# Altium project STATION.PRJPCB
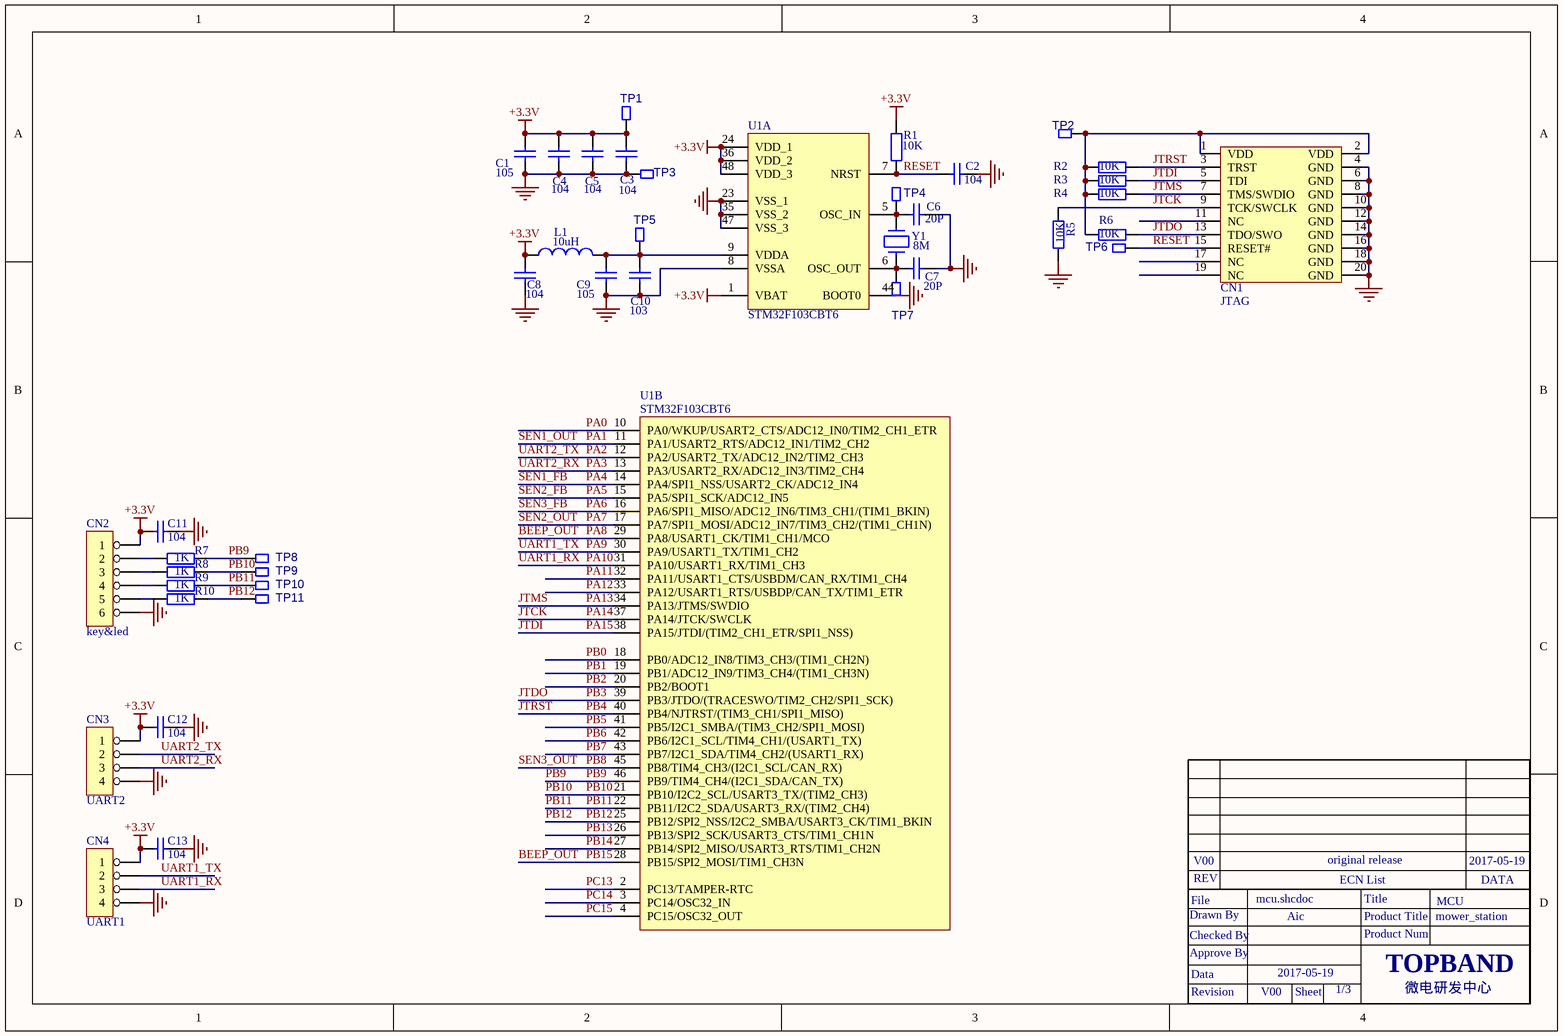
[diagram p0: mcu.SchDoc]
3 sheets, 192 parts. Net scope: flat (ports and power ports of the same name join across sheets).
Sheets:
  mcu.SchDoc
  power.SchDoc
  sensor.SchDoc

## Sheet mcu.SchDoc
size A4

### Parts
C1  105  [0603C]
C2  104  [0603C]
C3  104  [0603C]
C4  104  [0603C]
C5  104  [0603C]
C6  20P  [0603C]
C7  20P  [0603C]
C8  104  [0603C]
C9  105  [0603C]
C10  103  [0603C]
C11  104  [0603C]
C12  104  [0603C]
C13  104  [0603C]
CN1  JTAG  [JTAG_20]
CN2  key&led  [CON6-2.54]
CN3  UART2  [CON4-2.54]
CN4  UART1  [CON4-2.54]
L1  10uH  [0805L-BOT]
R1  10K  [0603R]
R2  10K  [0603R]
R3  10K  [0603R]
R4  10K  [0603R]
R5  10K  [0603R]
R6  10K  [0603R]
R7  1K  [0603R]
R8  1K  [0603R]
R9  1K  [0603R]
R10  1K  [0603R]
TP1  TP  [TEST-0.8MM]  (value not drawn)
TP2  TP  [TEST-0.8MM]  (value not drawn)
TP3  TP  [TEST-0.8MM]  (value not drawn)
TP4  TP  [TEST-0.8MM]  (value not drawn)
TP5  TP  [TEST-0.8MM]  (value not drawn)
TP6  TP  [TEST-0.8MM]  (value not drawn)
TP7  TP  [TEST-0.8MM]  (value not drawn)
TP8  TP  [TEST-0.8MM]  (value not drawn)
TP9  TP  [TEST-0.8MM]  (value not drawn)
TP10  TP  [TEST-0.8MM]  (value not drawn)
TP11  TP  [TEST-0.8MM]  (value not drawn)
U1  STM32F103CBT6  [LQFP48]  (parts A,B of 2)
Y1  8M  [XTAL-J]

### Nets
+3.3V: C1.1 C3.1 C4.1 C5.1 C8.1 C11.1 C12.1 C13.1 CN2.1 CN3.1 CN4.1 L1.1 R1.1 TP1.1 U1.1(VBAT) U1.24(VDD_1) U1.36(VDD_2) U1.48(VDD_3)
GND: C1.2 C2.1 C3.2 C4.2 C5.2 C6.1 C7.1 C8.2 C9.2 C10.2 C11.2 C12.2 C13.2 CN1.4(GND) CN1.6(GND) CN1.8(GND) CN1.10(GND) CN1.12(GND) CN1.14(GND) CN1.16(GND) CN1.18(GND) CN1.20(GND) CN2.6 CN3.4 CN4.4 R5.2 TP3.1 U1.8(VSSA) U1.23(VSS_1) U1.35(VSS_2) U1.44(BOOT0) U1.47(VSS_3)  [project net +5V]
BEEP_OUT: U1.28(PB15/SPI2_MOSI/TIM1_CH3N) U1.29(PA8/USART1_CK/TIM1_CH1/MCO)  [also labelled PA8, PB15]
JTCK: CN1.9(TCK/SWCLK) R5.1 U1.37(PA14/JTCK/SWCLK)  [also labelled PA14]
JTDI: CN1.5(TDI) R3.1 U1.38(PA15/JTDI/(TIM2_CH1_ETR/SPI1_NSS))  [also labelled PA15]
JTDO: CN1.13(TDO/SWO) R6.1 U1.39(PB3/JTDO/(TRACESWO/TIM2_CH2/SPI1_SCK))  [also labelled PB3]
JTMS: CN1.7(TMS/SWDIO) R4.1 U1.34(PA13/JTMS/SWDIO)  [also labelled PA13]
JTRST: CN1.3(TRST) R2.1 U1.40(PB4/NJTRST/(TIM3_CH1/SPI1_MISO))  [also labelled PB4]
PA0: U1.10(PA0/WKUP/USART2_CTS/ADC12_IN0/TIM2_CH1_ETR)
PA1: U1.11(PA1/USART2_RTS/ADC12_IN1/TIM2_CH2)  [also labelled SEN1_OUT]
PA2: CN3.2 U1.12(PA2/USART2_TX/ADC12_IN2/TIM2_CH3)  [also labelled UART2_TX]
PA3: CN3.3 U1.13(PA3/USART2_RX/ADC12_IN3/TIM2_CH4)  [also labelled UART2_RX]
PA4: U1.14(PA4/SPI1_NSS/USART2_CK/ADC12_IN4)  [also labelled SEN1_FB]
PA5: U1.15(PA5/SPI1_SCK/ADC12_IN5)  [also labelled SEN2_FB]
PA6: U1.16(PA6/SPI1_MISO/ADC12_IN6/TIM3_CH1/(TIM1_BKIN))  [also labelled SEN3_FB]
PA7: U1.17(PA7/SPI1_MOSI/ADC12_IN7/TIM3_CH2/(TIM1_CH1N))  [also labelled SEN2_OUT]
PA9: CN4.2 U1.30(PA9/USART1_TX/TIM1_CH2)  [also labelled UART1_TX]
PA10: CN4.3 U1.31(PA10/USART1_RX/TIM1_CH3)  [also labelled UART1_RX]
PA11: U1.32(PA11/USART1_CTS/USBDM/CAN_RX/TIM1_CH4)
PA12: U1.33(PA12/USART1_RTS/USBDP/CAN_TX/TIM1_ETR)
PB0: U1.18(PB0/ADC12_IN8/TIM3_CH3/(TIM1_CH2N))
PB1: U1.19(PB1/ADC12_IN9/TIM3_CH4/(TIM1_CH3N))
PB2: U1.20(PB2/BOOT1)
PB5: U1.41(PB5/I2C1_SMBA/(TIM3_CH2/SPI1_MOSI))
PB6: U1.42(PB6/I2C1_SCL/TIM4_CH1/(USART1_TX))
PB7: U1.43(PB7/I2C1_SDA/TIM4_CH2/(USART1_RX))
PB8: U1.45(PB8/TIM4_CH3/(I2C1_SCL/CAN_RX))  [also labelled SEN3_OUT]
PB9: R7.2 TP8.1 U1.46(PB9/TIM4_CH4/(I2C1_SDA/CAN_TX))
PB10: R8.2 TP9.1 U1.21(PB10/I2C2_SCL/USART3_TX/(TIM2_CH3))
PB11: R9.2 TP10.1 U1.22(PB11/I2C2_SDA/USART3_RX/(TIM2_CH4))
PB12: R10.2 TP11.1 U1.25(PB12/SPI2_NSS/I2C2_SMBA/USART3_CK/TIM1_BKIN)
PB13: U1.26(PB13/SPI2_SCK/USART3_CTS/TIM1_CH1N)
PB14: U1.27(PB14/SPI2_MISO/USART3_RTS/TIM1_CH2N)
PC13: U1.2(PC13/TAMPER-RTC)
PC14: U1.3(PC14/OSC32_IN)
PC15: U1.4(PC15/OSC32_OUT)
RESET: C2.2 CN1.15(RESET#) R1.2 TP6.1 U1.7(NRST)
NetC6_2: C6.2 TP4.1 U1.5(OSC_IN) Y1.2
NetC7_2: C7.2 TP7.1 U1.6(OSC_OUT) Y1.1
NetC9_1: C9.1 C10.1 L1.2 TP5.1 U1.9(VDDA)
NetCN1_1: CN1.1(VDD) CN1.2(VDD) R2.2 R3.2 R4.2 R6.2 TP2.1
NetCN2_2: CN2.2 R7.1
NetCN2_3: CN2.3 R8.1
NetCN2_4: CN2.4 R9.1
NetCN2_5: CN2.5 R10.1

Not connected (* = marked no-connect by the designer): CN1 11(NC) 17(NC) 19(NC)

### Notes on the sheet
- Drawn By
- File
- REV
- V00
- mcu.shcdoc
- Aic
- original release
- ECN List
- Product Title
- Title
- mower_station
- MCU
- 2017-05-19
- DATA
- Approve By
- Checked By
- Data
- Product Num
- TOPBAND
- Revision
- Sheet
- 1/3
- 微电研发中心

### Library data of the parts
C1-C13 = Cap(0603): Component Kind: standard; Component Type: standard
CN2 = 6Pin: 插座; U_TABLE: U_SAM01021601; id: 34; Part Number: 6Pin; Component Kind: Standard; Component Type: Standard; Designator: 6Pin; Pin Count: 6
CN3 CN4 = 4Pin(2~3.96mm): 插座; U_TABLE: U_SAM01021601; id: 28; Part Number: 4Pin(2~3.96mm); Component Kind: Standard; Component Type: Standard; Designator: 4Pin(2~3.96mm); Footprint: CON4-2.0; Pin Count: 4
L1 = Inductor(0805): 电感; U_TABLE: U_SAM010207; id: 140; Part Number: Inductor(0805); Component Kind: standard; Component Type: standard
R1-R6 = Res2: Resistor; Value: 1K; 物料编码: 150103083; Published: 8-Jun-2000; LatestRevisionDate: 17-Jul-2002; LatestRevisionNote: Re-released for DXP Platform.; PackageReference: AXIAL-0.4; Publisher: Altium Limited
R7-R10 = Res(0603): 120100221; U_TABLE: U_SAM010201; id: 106; Description: 电阻器; U_ITEM_ID（物料编码）: 120101813; U_100114（SAP物料描述）: SMT电阻RR0603_1502_F_1/16W_50V_国巨_; U_100012（标称值-文本）: 1502; U_100116（标称值-浮点）: 15; U_100013（单位）: KΩ; U_100083（允许偏差）: F; U_100029（额定功率）: 1/16W; U_100040（封装方式）: RR0603; U_100049（极限电压）: 50V; U_100047（环保属性）: 环保; U_100107（工厂BOM使用频率）: 2000:8;; U_100105（工厂库存）: 1200:0.000;2000:3965.000;3000:0.000;; U_100117（工厂采购量）: 2000:5000.000;; Part Number: Res(0603); Component Kind: standard; Component Type: standard; U_100086（指定供应商）: 国巨
U1 = STM32F103x8
Y1 = XTAL-J: 晶振; U_TABLE: U_SAM010212; id: 101; Part Number: XTAL-J; Component Kind: standard; Component Type: standard; Pin Count: 2

## Sheet power.SchDoc
size A4
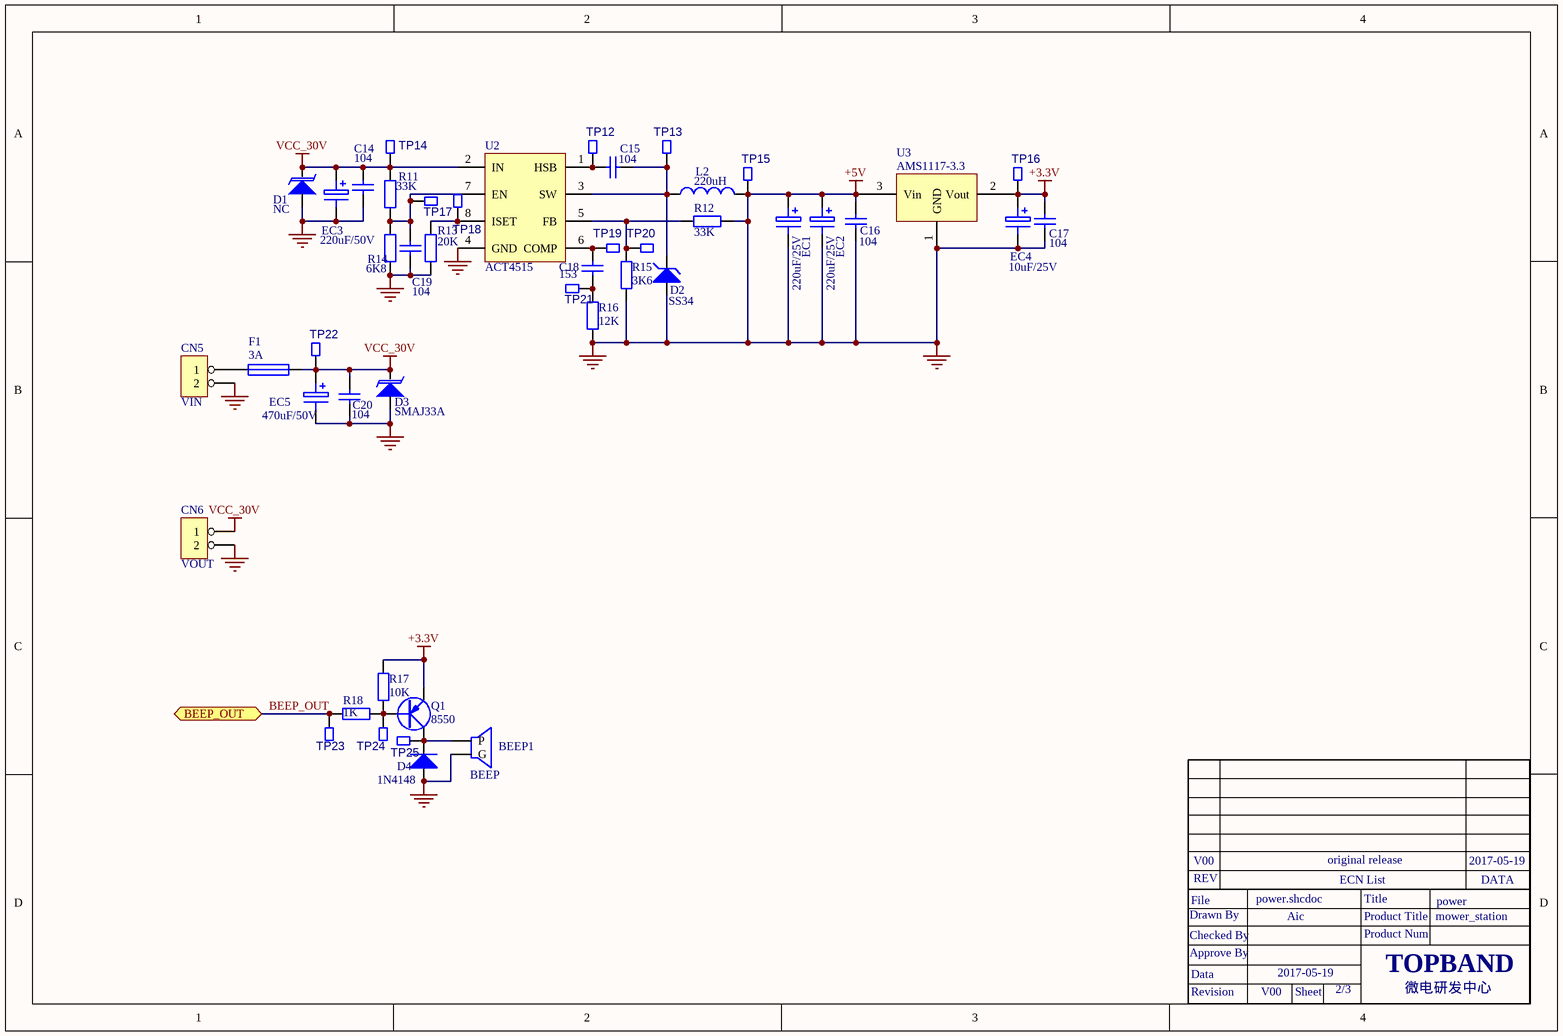
[diagram p1: power.SchDoc]

### Parts
BEEP1  BEEP  [BELL-5]
C14  104  [0603C]
C15  104  [0603C]
C16  104  [0603C]
C17  104  [0603C]
C18  153  [0603C]
C19  104  [0603C]
C20  104  [0805C]
CN5  VIN  [CON2-2.54]
CN6  VOUT  [CON2-2.54]
D1  NC  [SOD-123]
D2  SS34  [SMA]
D3  SMAJ33A  [DO-214AC]
D4  1N4148  [SOD-123]
EC1  220uF/25V  [EC10]
EC2  220uF/25V  [EC10]
EC3  220uF/50V  [EC10]
EC4  10uF/25V  [EC4]
EC5  470uF/50V  [EC12.5]
F1  3A  [0603]
L2  220uH  [150700618]
Q1  8550  [SOT-23-BCE]
R11  33K  [0603R]
R12  33K  [0603R]
R13  20K  [0603R]
R14  6K8  [0603R]
R15  3K6  [0603R]
R16  12K  [0603R]
R17  10K  [0603R]
R18  1K  [0603R]
TP12  TP  [TEST-0.8MM]  (value not drawn)
TP13  TP  [TEST-0.8MM]  (value not drawn)
TP14  TP  [TEST-0.8MM]  (value not drawn)
TP15  TP  [TEST-0.8MM]  (value not drawn)
TP16  TP  [TEST-0.8MM]  (value not drawn)
TP17  TP  [TEST-0.8MM]  (value not drawn)
TP18  TP  [TEST-0.8MM]  (value not drawn)
TP19  TP  [TEST-0.8MM]  (value not drawn)
TP20  TP  [TEST-0.8MM]  (value not drawn)
TP21  TP  [TEST-0.8MM]  (value not drawn)
TP22  TP  [TEST-0.8MM]  (value not drawn)
TP23  TP  [TEST-0.8MM]  (value not drawn)
TP24  TP  [TEST-0.8MM]  (value not drawn)
TP25  TP  [TEST-0.8MM]  (value not drawn)
U2  ACT4515  [SOP-8]
U3  AMS1117-3.3  [SOT-223]

### Ports
BEEP_OUT

### Nets
+3.3V: C17.1 EC4.1 Q1.E R17.2 TP16.1 U3.2(Vout)
+5V: BEEP1.2(G) C14.2 C16.1 C16.2 C17.2 C19.2 C20.1 CN5.2 CN6.2 D1.A D2.A D3.A D4.A EC1.1 EC1.2 EC2.1 EC2.2 EC3.2 EC4.2 EC5.2 L2.2 R12.1 R13.2 R14.2 R15.1 R16.1 TP15.1 U2.4(GND) U3.1(GND) U3.3(Vin)  [also labelled GND]
VCC_30V: C14.1 C20.2 CN6.1 D1.K D3.K EC3.1 EC5.1 F1.2 R11.1 TP14.1 TP22.1 U2.2(IN)
BEEP_OUT: R18.1 TP23.1 ; port BEEP_OUT
NetBEEP1_1: BEEP1.1(P) D4.K Q1.C TP25.1
NetC15_1: C15.1 TP12.1 U2.1(HSB)
NetC15_2: C15.2 D2.K L2.1 TP13.1 U2.3(SW)
NetC18_1: C18.1 TP19.1 U2.6(COMP)
NetC18_2: C18.2 R16.2 TP21.1
NetC19_1: C19.1 R11.2 R14.1 TP17.1 U2.7(EN)
NetCN5_1: CN5.1 F1.1
NetQ1_B: Q1.B R17.1 R18.2 TP24.1
NetR12_2: R12.2 R15.2 TP20.1 U2.5(FB)
NetR13_1: R13.1 TP18.1 U2.8(ISET)

### Notes on the sheet
- Drawn By
- File
- REV
- V00
- power.shcdoc
- Aic
- original release
- ECN List
- Product Title
- Title
- mower_station
- power
- 2017-05-19
- DATA
- Approve By
- Checked By
- Data
- Product Num
- TOPBAND
- Revision
- Sheet
- 2/3
- 微电研发中心

### Library data of the parts
C14-C20 = Cap(0603): Component Kind: standard; Component Type: standard
CN5 CN6 = 2Pin(卧式): 插座; U_TABLE: U_SAM01021601; id: 20; Part Number: 2Pin(卧式); Component Kind: Standard; Component Type: Standard; Designator: 2Pin(卧式); Footprint: CON2-2.54卧式; Pin Count: 2
D1 = Diode(TVS_贴片)_1: TVS管; U_TABLE: U_SAM010203; id: 28; Part Number: Diode(TVS_贴片)_1; Component Kind: standard; Component Type: standard; Pin Count: 2
D2 = D Zener(贴片): 120301465; U_TABLE: U_SAM010203; id: 25; Description: 稳压二极管; Part Number: D Zener(贴片); Component Kind: standard; Component Type: standard; Pin Count: 2
D3 = Diode(TVS_贴片)_1: 120301346; U_TABLE: U_SAM010203; id: 28; Description: TVS管; Part Number: Diode(TVS_贴片)_1; Component Kind: standard; Component Type: standard; Pin Count: 2
D4 = Diode(DO-35)-D: 二极管; U_TABLE: U_SAM010203; id: 32; Part Number: Diode(DO-35)-D; Component Kind: standard; Component Type: standard; Pin Count: 2
EC1-EC4 = Electro(2.5mm): 电解电容; U_TABLE: U_SAM010202; id: 42; Part Number: Electro(2.5mm); Component Kind: standard; Component Type: standard; Pin Count: 2
EC5 = Electro(2.5mm): 150200079; U_TABLE: U_SAM010202; id: 42; Description: 电解电容; Part Number: Electro(2.5mm); Component Kind: standard; Component Type: standard; Pin Count: 2
F1 = Fuse(1206): 121100112; U_TABLE: U_SAM010211; id: 119; Description: 保险管; Part Number: Fuse(1206); Component Kind: standard; Component Type: standard
L2 = Inductor(0805): 150700618; U_TABLE: U_SAM010207; id: 140; Description: 电感; Part Number: Inductor(0805); Component Kind: standard; Component Type: standard
Q1 = PNP(贴片): 三极管; U_TABLE: U_SAM010204; id: 20; Part Number: PNP(贴片); Component Kind: standard; Component Type: standard; Pin Count: 3
R11-R16 = Res2: Resistor; Value: 1K; 物料编码: 150103083; Published: 8-Jun-2000; LatestRevisionDate: 17-Jul-2002; LatestRevisionNote: Re-released for DXP Platform.; PackageReference: AXIAL-0.4; Publisher: Altium Limited
R17 R18 = Res(0603): as R7 on sheet mcu; Part Number: Res(0603); Component Kind: standard; Component Type: standard; U_100086（指定供应商）: 国巨

## Sheet sensor.SchDoc
size A4
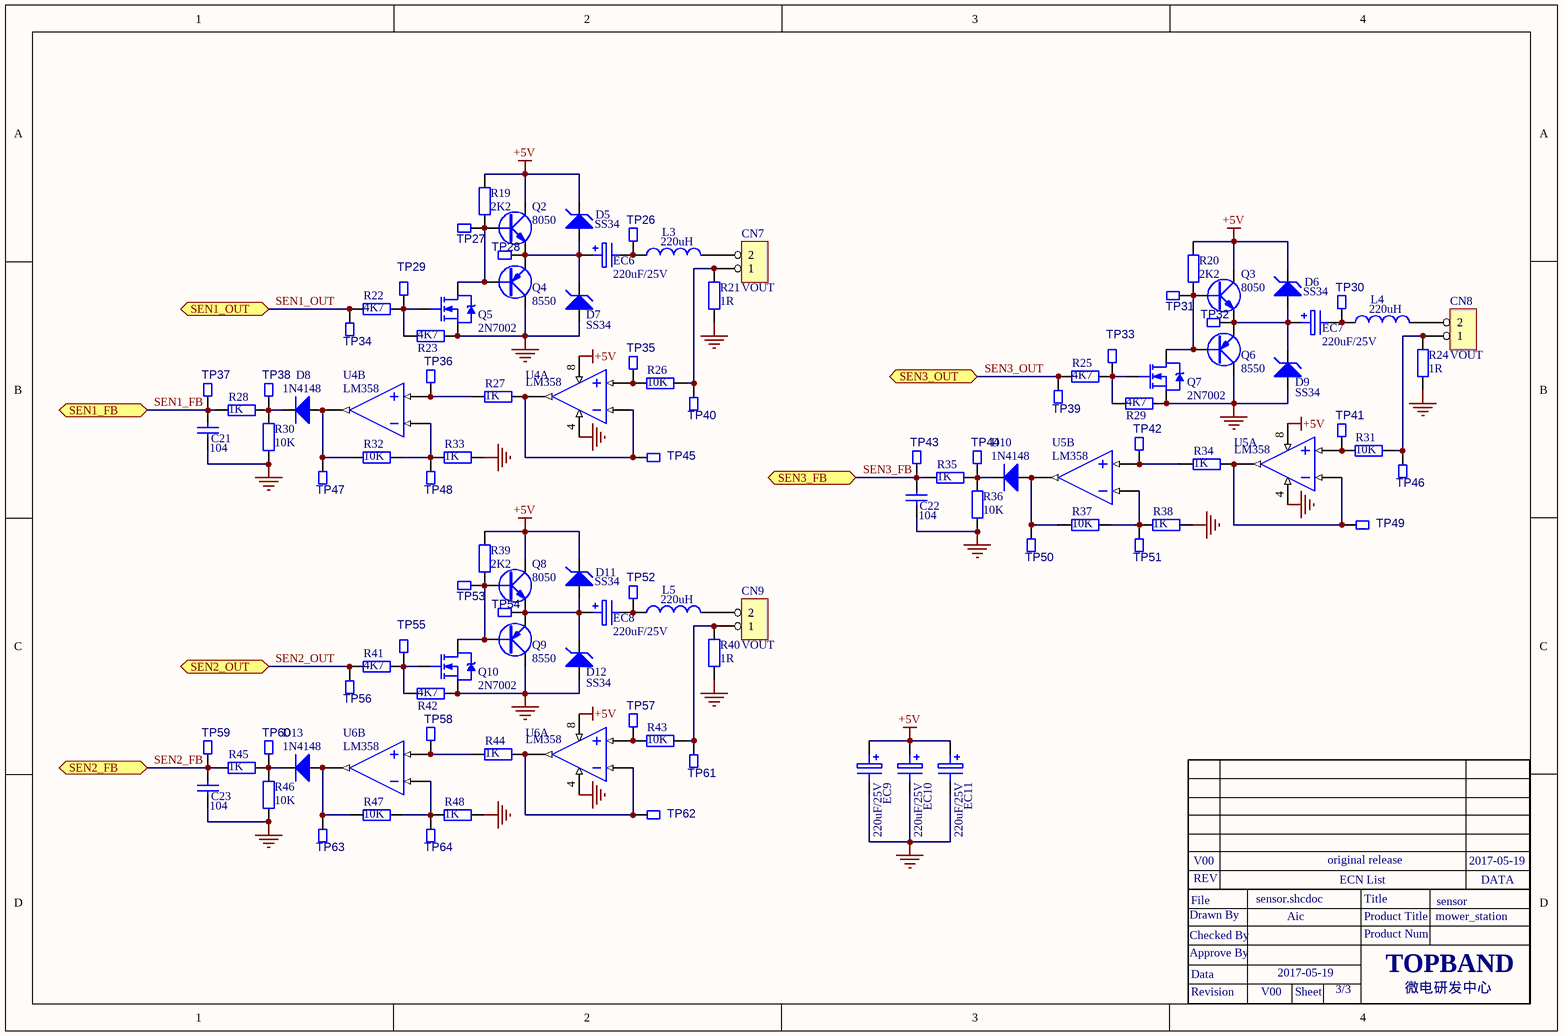
[diagram p2: sensor.SchDoc]

### Parts
C21  104  [0805C]
C22  104  [0805C]
C23  104  [0805C]
CN7  VOUT  [CON2-2.54]
CN8  VOUT  [CON2-2.54]
CN9  VOUT  [CON2-2.54]
D5  SS34  [SMA]
D6  SS34  [SMA]
D7  SS34  [SMA]
D8  1N4148  [SOD-123]
D9  SS34  [SMA]
D10  1N4148  [SOD-123]
D11  SS34  [SMA]
D12  SS34  [SMA]
D13  1N4148  [SOD-123]
EC6  220uF/25V  [EC10]
EC7  220uF/25V  [EC10]
EC8  220uF/25V  [EC10]
EC9  220uF/25V  [EC10]
EC10  220uF/25V  [EC10]
EC11  220uF/25V  [EC10]
L3  220uH  [150700618]
L4  220uH  [150700618]
L5  220uH  [150700618]
Q2  8050  [to-92]
Q3  8050  [to-92]
Q4  8550  [to-92]
Q5  2N7002  [SOT-23-GDS]
Q6  8550  [to-92]
Q7  2N7002  [SOT-23-GDS]
Q8  8050  [to-92]
Q9  8550  [to-92]
Q10  2N7002  [SOT-23-GDS]
R19  2K2  [0603R]
R20  2K2  [0603R]
R21  1R  [2512R]
R22  4K7  [0603R]
R23  4K7  [0603R]
R24  1R  [2512R]
R25  4K7  [0603R]
R26  10K  [0603R]
R27  1K  [0603R]
R28  1K  [0603R]
R29  4K7  [0603R]
R30  10K  [0603R]
R31  10K  [0603R]
R32  10K  [0603R]
R33  1K  [0603R]
R34  1K  [0603R]
R35  1K  [0603R]
R36  10K  [0603R]
R37  10K  [0603R]
R38  1K  [0603R]
R39  2K2  [0603R]
R40  1R  [2512R]
R41  4K7  [0603R]
R42  4K7  [0603R]
R43  10K  [0603R]
R44  1K  [0603R]
R45  1K  [0603R]
R46  10K  [0603R]
R47  10K  [0603R]
R48  1K  [0603R]
TP26  TP  [TEST-0.8MM]  (value not drawn)
TP27  TP  [TEST-0.8MM]  (value not drawn)
TP28  TP  [TEST-0.8MM]  (value not drawn)
TP29  TP  [TEST-0.8MM]  (value not drawn)
TP30  TP  [TEST-0.8MM]  (value not drawn)
TP31  TP  [TEST-0.8MM]  (value not drawn)
TP32  TP  [TEST-0.8MM]  (value not drawn)
TP33  TP  [TEST-0.8MM]  (value not drawn)
TP34  TP  [TEST-0.8MM]  (value not drawn)
TP35  TP  [TEST-0.8MM]  (value not drawn)
TP36  TP  [TEST-0.8MM]  (value not drawn)
TP37  TP  [TEST-0.8MM]  (value not drawn)
TP38  TP  [TEST-0.8MM]  (value not drawn)
TP39  TP  [TEST-0.8MM]  (value not drawn)
TP40  TP  [TEST-0.8MM]  (value not drawn)
TP41  TP  [TEST-0.8MM]  (value not drawn)
TP42  TP  [TEST-0.8MM]  (value not drawn)
TP43  TP  [TEST-0.8MM]  (value not drawn)
TP44  TP  [TEST-0.8MM]  (value not drawn)
TP45  TP  [TEST-0.8MM]  (value not drawn)
TP46  TP  [TEST-0.8MM]  (value not drawn)
TP47  TP  [TEST-0.8MM]  (value not drawn)
TP48  TP  [TEST-0.8MM]  (value not drawn)
TP49  TP  [TEST-0.8MM]  (value not drawn)
TP50  TP  [TEST-0.8MM]  (value not drawn)
TP51  TP  [TEST-0.8MM]  (value not drawn)
TP52  TP  [TEST-0.8MM]  (value not drawn)
TP53  TP  [TEST-0.8MM]  (value not drawn)
TP54  TP  [TEST-0.8MM]  (value not drawn)
TP55  TP  [TEST-0.8MM]  (value not drawn)
TP56  TP  [TEST-0.8MM]  (value not drawn)
TP57  TP  [TEST-0.8MM]  (value not drawn)
TP58  TP  [TEST-0.8MM]  (value not drawn)
TP59  TP  [TEST-0.8MM]  (value not drawn)
TP60  TP  [TEST-0.8MM]  (value not drawn)
TP61  TP  [TEST-0.8MM]  (value not drawn)
TP62  TP  [TEST-0.8MM]  (value not drawn)
TP63  TP  [TEST-0.8MM]  (value not drawn)
TP64  TP  [TEST-0.8MM]  (value not drawn)
U4  LM358  [SO-8]  (parts A,B of 2)
U5  LM358  [SO-8]  (parts A,B of 2)
U6  LM358  [SO-8]  (parts A,B of 2)

### Ports
SEN1_FB, SEN1_OUT, SEN2_FB, SEN2_OUT, SEN3_FB, SEN3_OUT

### Nets
+5V: C21.1 C22.1 C23.1 D5.K D6.K D7.A D9.A D11.K D12.A EC9.1 EC9.2 EC10.1 EC10.2 EC11.1 EC11.2 Q2.C Q3.C Q4.C Q5.S Q6.C Q7.S Q8.C Q9.C Q10.S R19.2 R20.2 R21.2 R23.1 R24.2 R29.1 R30.1 R33.2 R36.1 R38.2 R39.2 R40.2 R42.1 R46.1 R48.2 U4.4(GND) U4.8(VCC) U5.4(GND) U5.8(VCC) U6.4(GND) U6.8(VCC)  [also labelled GND]
SEN1_FB: C21.2 R28.1 TP37.1 ; port SEN1_FB
SEN1_OUT: R22.2 TP34.1 ; port SEN1_OUT
SEN2_FB: C23.2 R45.1 TP59.1 ; port SEN2_FB
SEN2_OUT: R41.2 TP56.1 ; port SEN2_OUT
SEN3_FB: C22.2 R35.1 TP43.1 ; port SEN3_FB
SEN3_OUT: R25.2 TP39.1 ; port SEN3_OUT
NetCN7_1: CN7.1 R21.1 R26.2 TP40.1
NetCN7_2: CN7.2 L3.2
NetCN8_1: CN8.1 R24.1 R31.2 TP46.1
NetCN8_2: CN8.2 L4.2
NetCN9_1: CN9.1 R40.1 R43.2 TP61.1
NetCN9_2: CN9.2 L5.2
NetD5_A: D5.A D7.K EC6.1 Q2.E Q4.E TP28.1
NetD6_A: D6.A D9.K EC7.1 Q3.E Q6.E TP32.1
NetD8_A: D8.A R32.1 TP47.1 U4.1(OUT2)
NetD8_K: D8.K R28.2 R30.2 TP38.1
NetD10_A: D10.A R37.1 TP50.1 U5.1(OUT2)
NetD10_K: D10.K R35.2 R36.2 TP44.1
NetD11_A: D11.A D12.K EC8.1 Q8.E Q9.E TP54.1
NetD13_A: D13.A R47.1 TP63.1 U6.1(OUT2)
NetD13_K: D13.K R45.2 R46.2 TP60.1
NetEC6_2: EC6.2 L3.1 TP26.1
NetEC7_2: EC7.2 L4.1 TP30.1
NetEC8_2: EC8.2 L5.1 TP52.1
NetQ2_B: Q2.B Q4.B Q5.D R19.1 TP27.1
NetQ3_B: Q3.B Q6.B Q7.D R20.1 TP31.1
NetQ5_G: Q5.G R22.1 R23.2 TP29.1
NetQ7_G: Q7.G R25.1 R29.2 TP33.1
NetQ8_B: Q8.B Q9.B Q10.D R39.1 TP53.1
NetQ10_G: Q10.G R41.1 R42.2 TP55.1
NetR26_1: R26.1 TP35.1 U4.5(+IN1)
NetR27_1: R27.1 TP36.1 U4.3(IN2+)
NetR27_2: R27.2 TP45.1 U4.6(-IN1) U4.7(OUT1)
NetR31_1: R31.1 TP41.1 U5.5(+IN1)
NetR32_2: R32.2 R33.1 TP48.1 U4.2(-IN2)
NetR34_1: R34.1 TP42.1 U5.3(IN2+)
NetR34_2: R34.2 TP49.1 U5.6(-IN1) U5.7(OUT1)
NetR37_2: R37.2 R38.1 TP51.1 U5.2(-IN2)
NetR43_1: R43.1 TP57.1 U6.5(+IN1)
NetR44_1: R44.1 TP58.1 U6.3(IN2+)
NetR44_2: R44.2 TP62.1 U6.6(-IN1) U6.7(OUT1)
NetR47_2: R47.2 R48.1 TP64.1 U6.2(-IN2)

### Notes on the sheet
- Drawn By
- File
- REV
- V00
- sensor.shcdoc
- Aic
- original release
- ECN List
- Product Title
- Title
- mower_station
- sensor
- 2017-05-19
- DATA
- Approve By
- Checked By
- Data
- Product Num
- TOPBAND
- Revision
- Sheet
- 3/3
- 微电研发中心

### Library data of the parts
C21-C23 = Cap(0603): Component Kind: standard; Component Type: standard
CN7-CN9 = 2Pin(卧式): 插座; U_TABLE: U_SAM01021601; id: 20; Part Number: 2Pin(卧式); Component Kind: Standard; Component Type: Standard; Designator: 2Pin(卧式); Footprint: CON2-2.54卧式; Pin Count: 2
D5-D7 D9 D11 D12 = D Zener(贴片): as D2 on sheet power; Part Number: D Zener(贴片); Component Kind: standard; Component Type: standard; Pin Count: 2
D8 D10 D13 = Diode(DO-35)-D: 二极管; U_TABLE: U_SAM010203; id: 32; Part Number: Diode(DO-35)-D; Component Kind: standard; Component Type: standard; Pin Count: 2
EC6-EC11 = Electro(2.5mm): 电解电容; U_TABLE: U_SAM010202; id: 42; Part Number: Electro(2.5mm); Component Kind: standard; Component Type: standard; Pin Count: 2
L3-L5 = Inductor(0805): as L2 on sheet power; Part Number: Inductor(0805); Component Kind: standard; Component Type: standard
Q2 Q3 Q8 = NPN(贴片): 三极管; U_TABLE: U_SAM010204; id: 18; Part Number: NPN(贴片); Component Kind: standard; Component Type: standard; Pin Count: 3
Q4 Q6 Q9 = PNP(贴片): 三极管; U_TABLE: U_SAM010204; id: 20; Part Number: PNP(贴片); Component Kind: standard; Component Type: standard; Pin Count: 3
Q5 Q7 Q10 = NMOS-2: MOS管; U_TABLE: U_SAM010204; id: 17; Part Number: NMOS-2; Component Kind: standard; Component Type: standard; Pin Count: 3
R19-R25 R29 R39-R42 = Res2: Resistor; Value: 1K; 物料编码: 150103083; Published: 8-Jun-2000; LatestRevisionDate: 17-Jul-2002; LatestRevisionNote: Re-released for DXP Platform.; PackageReference: AXIAL-0.4; Publisher: Altium Limited
R26 R30-R32 R36 R37 R43 R46 R47 = Res2: Resistor; Value: 1K; Published: 8-Jun-2000; LatestRevisionDate: 17-Jul-2002; LatestRevisionNote: Re-released for DXP Platform.; PackageReference: AXIAL-0.4; Publisher: Altium Limited
R27 R28 R33-R35 R38 R44 R45 R48 = Res2: Resistor; Published: 8-Jun-2000; LatestRevisionDate: 17-Jul-2002; LatestRevisionNote: Re-released for DXP Platform.; PackageReference: AXIAL-0.4; Publisher: Altium Limited; Value: 1K
U4-U6 = IC_LM358: 121000225; U_TABLE: U_SAM010210; Description: 集成电路; id: 83; U_ITEM_ID（物料编码）: 121000100; U_100114（SAP物料描述）: SMT运放LM358_SO-8_TI_环保; U_100047（环保属性）: 环保; U_100107（工厂BOM使用频率）: 1000:1;1500:12;3000:7;5000:14;; U_100105（工厂库存）: 1000:7508.000;1500:160.000;2000:0.000;3000:485.000;5000:1542.000;; U_100117（工厂采购量）: 1000:7500.000;1500:300.000;3000:2500.000;5000:7500.000;; Part Number: IC_LM358; Component Kind: standard; Component Type: standard; Designator: IC_LM358; Footprint: DIP14; Pin Count: 8; U_100076（型号）: LM358; U_100040（封装方式）: SO-8; U_100086（指定供应商）: TI

## Nets that join several sheets
+3.3V: mcu (18 pins), power (6 pins)
+5V: mcu (32 pins), power (30 pins), sensor (45 pins)